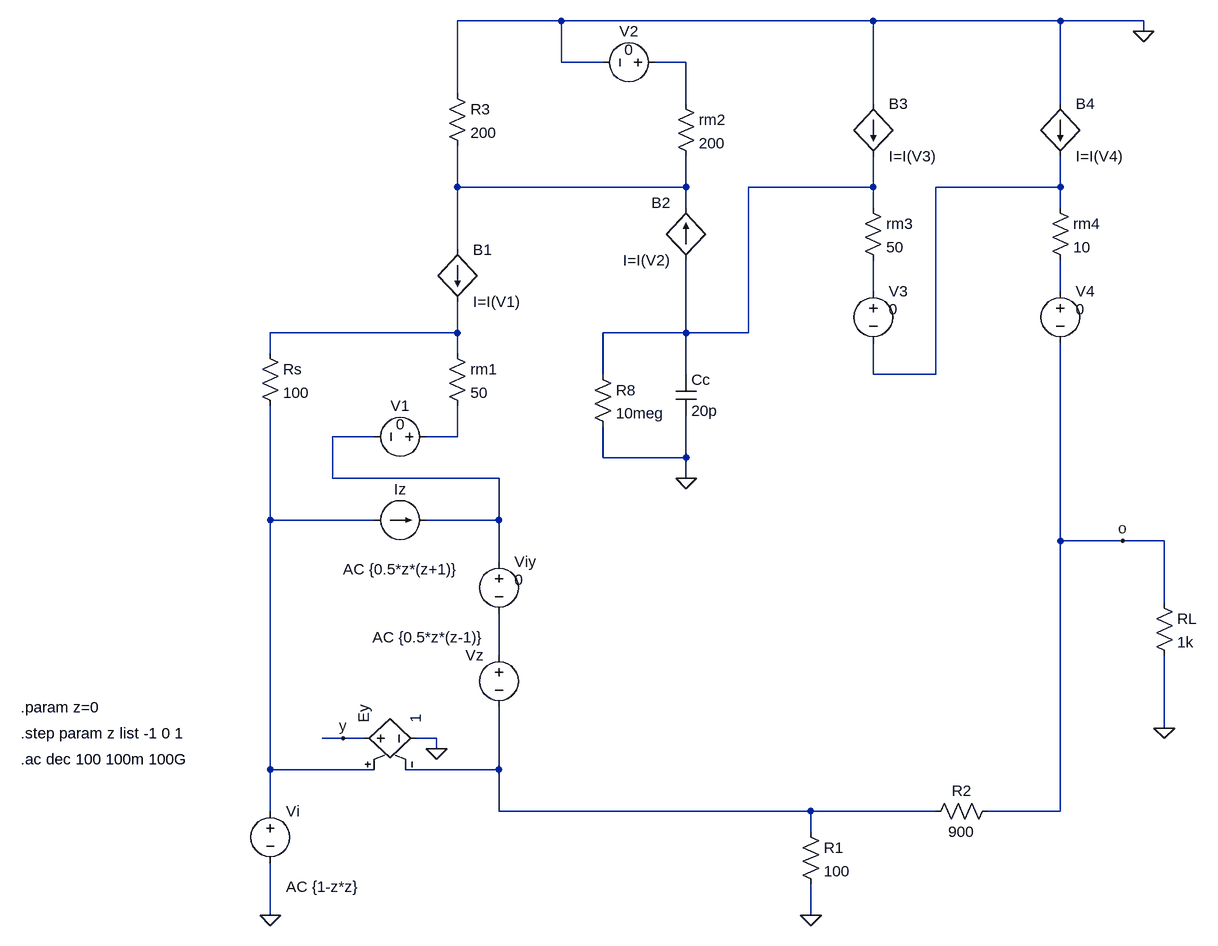
[diagram p0: schematic article1.asc]
article1.asc, the LTspice schematic file:
Version 4
SHEET 1 1316 680
WIRE 320 -960 160 -960
WIRE 800 -960 320 -960
WIRE 1088 -960 800 -960
WIRE 1216 -960 1088 -960
WIRE 1216 -944 1216 -960
WIRE 320 -896 320 -960
WIRE 384 -896 320 -896
WIRE 512 -896 464 -896
WIRE 160 -848 160 -960
WIRE 512 -832 512 -896
WIRE 800 -832 800 -960
WIRE 1088 -832 1088 -960
WIRE 160 -704 160 -768
WIRE 512 -704 512 -752
WIRE 512 -704 160 -704
WIRE 800 -704 800 -752
WIRE 800 -704 608 -704
WIRE 1088 -704 1088 -752
WIRE 1088 -704 896 -704
WIRE 512 -672 512 -704
WIRE 800 -672 800 -704
WIRE 1088 -672 1088 -704
WIRE 160 -608 160 -704
WIRE 800 -544 800 -592
WIRE 1088 -544 1088 -592
WIRE 160 -480 160 -528
WIRE 160 -480 -128 -480
WIRE 512 -480 512 -592
WIRE 512 -480 384 -480
WIRE 608 -480 608 -704
WIRE 608 -480 512 -480
WIRE -128 -448 -128 -480
WIRE 160 -448 160 -480
WIRE 384 -416 384 -480
WIRE 512 -416 512 -480
WIRE 800 -416 800 -464
WIRE 896 -416 896 -704
WIRE 896 -416 800 -416
WIRE 32 -320 -32 -320
WIRE 160 -320 160 -368
WIRE 160 -320 112 -320
WIRE 384 -288 384 -336
WIRE 512 -288 512 -352
WIRE 512 -288 384 -288
WIRE -32 -256 -32 -320
WIRE 224 -256 -32 -256
WIRE 512 -256 512 -288
WIRE -128 -192 -128 -368
WIRE 32 -192 -128 -192
WIRE 224 -192 224 -256
WIRE 224 -192 112 -192
WIRE 1088 -160 1088 -464
WIRE 1184 -160 1088 -160
WIRE 1248 -160 1184 -160
WIRE 224 -128 224 -192
WIRE 1248 -64 1248 -160
WIRE 224 16 224 -48
WIRE 1248 128 1248 16
WIRE -16 144 -48 144
WIRE 16 144 -16 144
WIRE 128 144 96 144
WIRE 128 160 128 144
WIRE -128 192 -128 -192
WIRE 32 192 -128 192
WIRE 224 192 224 96
WIRE 224 192 80 192
WIRE -128 256 -128 192
WIRE 224 256 224 192
WIRE 704 256 224 256
WIRE 896 256 704 256
WIRE 1088 256 1088 -160
WIRE 1088 256 976 256
WIRE 704 288 704 256
WIRE -128 416 -128 336
WIRE 704 416 704 368
FLAG -128 416 0
FLAG 128 160 0
FLAG -16 144 y
FLAG 512 -256 0
FLAG 1216 -944 0
FLAG 704 416 0
FLAG 1248 128 0
FLAG 1184 -160 o
SYMBOL voltage -128 240 R0
WINDOW 123 24 132 Left 2
WINDOW 39 0 0 Left 2
SYMATTR Value2 AC {1-z*z}
SYMATTR InstName Vi
SYMATTR Value ""
SYMBOL current 32 -192 R270
WINDOW 0 32 40 VTop 2
WINDOW 3 -32 40 VBottom 2
WINDOW 123 -60 40 VBottom 2
WINDOW 39 0 0 Left 2
SYMATTR InstName Iz
SYMATTR Value ""
SYMATTR Value2 AC {0.5*z*(z+1)}
SYMBOL voltage 224 -144 R0
WINDOW 123 0 0 Left 2
WINDOW 39 0 0 Left 2
WINDOW 3 24 44 Left 2
SYMATTR Value 0
SYMATTR InstName Viy
SYMBOL voltage 224 0 M0
WINDOW 123 24 -12 Left 2
WINDOW 39 0 0 Left 2
SYMATTR Value2 AC {0.5*z*(z-1)}
SYMATTR InstName Vz
SYMATTR Value ""
SYMBOL e 0 144 R270
SYMATTR InstName Ey
SYMATTR Value 1
SYMBOL res -144 -464 R0
SYMATTR InstName Rs
SYMATTR Value 100
SYMBOL voltage 128 -320 R90
WINDOW 0 -32 56 VBottom 2
WINDOW 3 -4 56 VBottom 2
WINDOW 123 0 0 Left 2
WINDOW 39 0 0 Left 2
SYMATTR InstName V1
SYMATTR Value 0
SYMBOL res 144 -464 R0
SYMATTR InstName rm1
SYMATTR Value 50
SYMBOL bi 160 -608 R0
SYMATTR InstName B1
SYMATTR Value I=I(V1)
SYMBOL res 144 -864 R0
SYMATTR InstName R3
SYMATTR Value 200
SYMBOL voltage 480 -896 R90
WINDOW 0 -32 56 VBottom 2
WINDOW 3 -4 56 VBottom 2
WINDOW 123 0 0 Left 2
WINDOW 39 0 0 Left 2
SYMATTR InstName V2
SYMATTR Value 0
SYMBOL res 496 -848 R0
SYMATTR InstName rm2
SYMATTR Value 200
SYMBOL bi 512 -592 R180
WINDOW 0 24 88 Left 2
WINDOW 3 24 0 Left 2
SYMATTR InstName B2
SYMATTR Value I=I(V2)
SYMBOL cap 496 -416 R0
SYMATTR InstName Cc
SYMATTR Value 20p
SYMBOL res 368 -432 R0
SYMATTR InstName R8
SYMATTR Value 10meg
SYMBOL bi 800 -832 R0
SYMATTR InstName B3
SYMATTR Value I=I(V3)
SYMBOL res 784 -688 R0
SYMATTR InstName rm3
SYMATTR Value 50
SYMBOL voltage 800 -560 R0
WINDOW 3 24 44 Left 2
WINDOW 123 0 0 Left 2
WINDOW 39 0 0 Left 2
SYMATTR Value 0
SYMATTR InstName V3
SYMBOL bi 1088 -832 R0
SYMATTR InstName B4
SYMATTR Value I=I(V4)
SYMBOL res 1072 -688 R0
SYMATTR InstName rm4
SYMATTR Value 10
SYMBOL voltage 1088 -560 R0
WINDOW 3 24 44 Left 2
WINDOW 123 0 0 Left 2
WINDOW 39 0 0 Left 2
SYMATTR Value 0
SYMATTR InstName V4
SYMBOL res 688 272 R0
SYMATTR InstName R1
SYMATTR Value 100
SYMBOL res 992 240 R90
WINDOW 0 0 56 VBottom 2
WINDOW 3 32 56 VTop 2
SYMATTR InstName R2
SYMATTR Value 900
SYMBOL res 1232 -80 R0
SYMATTR InstName RL
SYMATTR Value 1k
TEXT -512 176 Left 2 !.ac dec 100 100m 100G
TEXT -512 96 Left 2 !.param z=0
TEXT -512 136 Left 2 !.step param z list -1 0 1

The netlist it stands for:
* article1.asc
Vi N010 0 AC {1-z*z}
Iz N010 N008 AC {0.5*z*(z+1)}
Viy N008 N011 0
Vz N011 N012 AC {0.5*z*(z-1)}
Ey y 0 N010 N012 1
Rs N007 N010 100
V1 N009 N008 0
rm1 N007 N009 50
B1 N002 N007 I=I(V1)
R3 0 N002 200
V2 N001 0 0
rm2 N001 N002 200
B2 N003 N002 I=I(V2)
Cc N003 0 20p
R8 N003 0 10meg
B3 0 N003 I=I(V3)
rm3 N003 N005 50
V3 N005 N004 0
B4 0 N004 I=I(V4)
rm4 N004 N006 10
V4 N006 o 0
R1 N012 0 100
R2 o N012 900
RL o 0 1k
.ac dec 100 100m 100G
.param z=0
.step param z list -1 0 1
.backanno
.end